# Altium schematic sheet rpmsens.SchDoc
size A4
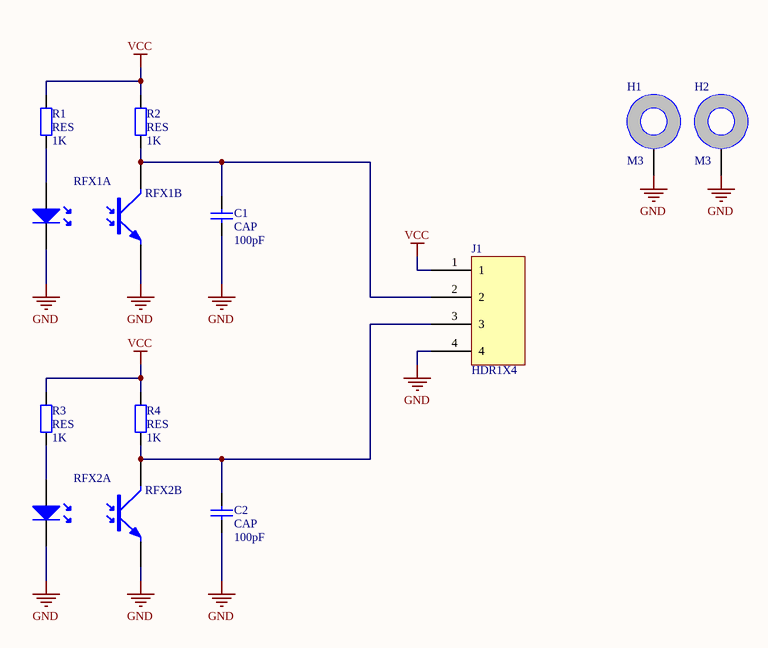
[diagram p0: rpmsens.SchDoc]

## Parts
C1  CAP  value 100pF  [CAPC1608X08M]
C2  CAP  value 100pF  [CAPC1608X08M]
H1  M3  [MOUNT_M3]
H2  M3  [MOUNT_M3]
J1  HDR1X4  [HEADER_1X4]
R1  RES  value 1K  [RESC1608X06M]
R2  RES  value 1K  [RESC1608X06M]
R3  RES  value 1K  [RESC1608X06M]
R4  RES  value 1K  [RESC1608X06M]
RFX1  (no value)  [RFX4]  (parts A,B of 2)
RFX2  (no value)  [RFX4]  (parts A,B of 2)

## Nets
GND: C1.1 C2.1 H1.1 H2.1 J1.4 RFX1.2(K) RFX1.4(E) RFX2.2(K) RFX2.4(E)
VCC: J1.1 R1.2 R2.2 R3.2 R4.2
NetC1_2: C1.2 J1.2 R2.1 RFX1.3(C)
NetC2_2: C2.2 J1.3 R4.1 RFX2.3(C)
NetR1_1: R1.1 RFX1.1(A)
NetR3_1: R3.1 RFX2.1(A)

## Library data of the parts
C1 C2 = CAP: Capacitor; Published: 8-Jun-2000; LatestRevisionDate: 17-Jul-2002; LatestRevisionNote: Re-released for DXP Platform.; PackageReference: RB7.6-15; Publisher: Altium Limited; PackageDescription: Polarized Capacitor (Radial); 2 Leads
H1 H2 = MOUNT_M3
J1 = HDR1X4: 4pin header
R1-R4 = RES: Resistor; Published: 8-Jun-2000; LatestRevisionDate: 17-Jul-2002; LatestRevisionNote: Re-released for DXP Platform.; PackageReference: AXIAL-0.4; Publisher: Altium Limited; PackageDescription: Axial Device, Thru-Hole; 2 Leads; 0.4 in Pin Spacing
RFX1 RFX2 = QRE113GR: SMT Reflective Object Sensor